# EAGLE design untitled (EAGLE 9.5.2)
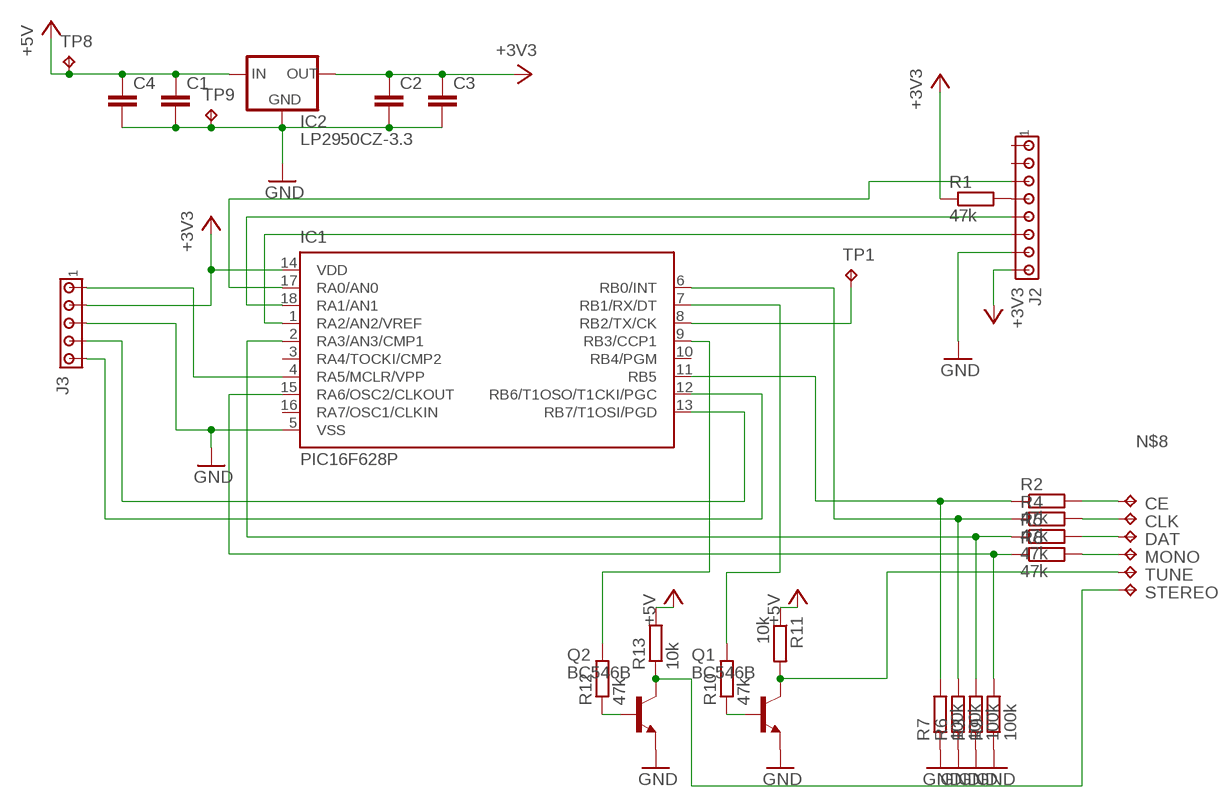
[diagram p0: schematic, sheet 1]

## Parts
C1  C-EU025-024X044  [C025-024X044]
C2  C-EU025-024X044  [C025-024X044]
C3  C-EU025-024X044  [C025-024X044]
C4  C-EU025-024X044  [C025-024X044]
CE  TPB1,27  [B1,27]
CLK  TPB1,27  [B1,27]
DAT  TPB1,27  [B1,27]
IC1  PIC16F628P  [DIL18]
IC2  LP2950CZ-3.3  [TO92]
J2  MTA08-100  [10X08MTA]
J3  MTA05-100  [10X05MTA]
MONO  TPB1,27  [B1,27]
Q1  BC546B  [TO92-EBC]
Q2  BC546B  [TO92-EBC]
R1  47k  R-EU_0204/7  [0204/7]
R2  47k  R-EU_0204/7  [0204/7]
R3  100k  R-EU_0204/7  [0204/7]
R4  47k  R-EU_0204/7  [0204/7]
R5  47k  R-EU_0204/7  [0204/7]
R6  100k  R-EU_0204/7  [0204/7]
R7  100k  R-EU_0204/7  [0204/7]
R8  47k  R-EU_0204/7  [0204/7]
R9  100k  R-EU_0204/7  [0204/7]
R10  47k  R-EU_0204/7  [0204/7]
R11  10k  R-EU_0204/7  [0204/7]
R12  47k  R-EU_0204/7  [0204/7]
R13  10k  R-EU_0204/7  [0204/7]
STEREO  TPB1,27  [B1,27]
TP1  TPB1,27  [B1,27]
TP8  TPB1,27  [B1,27]
TP9  TPB1,27  [B1,27]
TUNE  TPB1,27  [B1,27]

## Nets
+3V3: C2.1 C3.1 IC1.14(VDD) IC2.1(OUT) J2.8 J3.2 R1.1
+5V: C1.1 C4.1 IC2.3(IN) R11.1 R13.2 TP8.TP
GND: C1.2 C2.2 C3.2 C4.2 IC1.5(VSS) IC2.2(GND) J2.7 J3.3 Q1.E Q2.E R3.1 R6.1 R7.1 R9.1 TP9.TP
N$1: IC1.4(RA5/MCLR/VPP) J3.1
N$2: IC1.1(RA2/AN2/VREF) J2.6
N$3: IC1.18(RA1/AN1) J2.5
N$4: IC1.13(RB7/T1OSI/PGD) J3.4
N$5: IC1.12(RB6/T1OSO/T1CKI/PGC) J3.5
N$6: J2.4 R1.2
N$7: IC1.17(RA0/AN0) J2.3
N$8: CE.TP R2.2
N$9: IC1.8(RB2/TX/CK) TP1.TP
N$10: CLK.TP R4.2
N$11: DAT.TP R5.2
N$12: IC1.2(RA3/AN3/CMP1) R3.2 R5.1
N$13: IC1.6(RB0/INT) R4.1 R6.2
N$14: IC1.11(RB5) R2.1 R7.2
N$15: Q1.C R11.2 TUNE.TP
N$16: Q1.B R10.1
N$17: MONO.TP R8.2
N$18: IC1.15(RA6/OSC2/CLKOUT) R8.1 R9.2
N$19: Q2.C R13.1 STEREO.TP
N$20: IC1.7(RB1/RX/DT) R10.2
N$21: Q2.B R12.1
N$22: IC1.9(RB3/CCP1) R12.2
Unconnected: IC1.3(RA4/TOCKI/CMP2) IC1.10(RB4/PGM) IC1.16(RA7/OSC1/CLKIN) J2.1 J2.2

## Library data of the parts
C1-C4 = rcl:C-EU: CAPACITOR, European symbol; SPICEPREFIX: C
CE CLK DAT MONO STEREO TP1 TP8 TP9 TUNE = testpad:TP: Test pad
IC1 = microchip:PIC16F62*: FLASH-Based 8-Bit CMOS Microcontroller Source: http://ww1.microchip.com/downloads/en/DeviceDoc/40300C.pdf; MF: MICROCHIP; MPN: PIC16F628-04I/P; OC_FARNELL: 9760407; OC_NEWARK: 19C7272
IC2 = v-reg:LP2950?*: Source: http://cache.national.com/ds/LP/LP2950.pdf
J2 = con-amp:MTA08-100: AMP connector
J3 = con-amp:MTA05-100: AMP connector
Q1 Q2 = transistor-npn:BC546*: NPN Transistor
R1-R13 = rcl:R-EU_: RESISTOR, European symbol; SPICEPREFIX: R

## Board
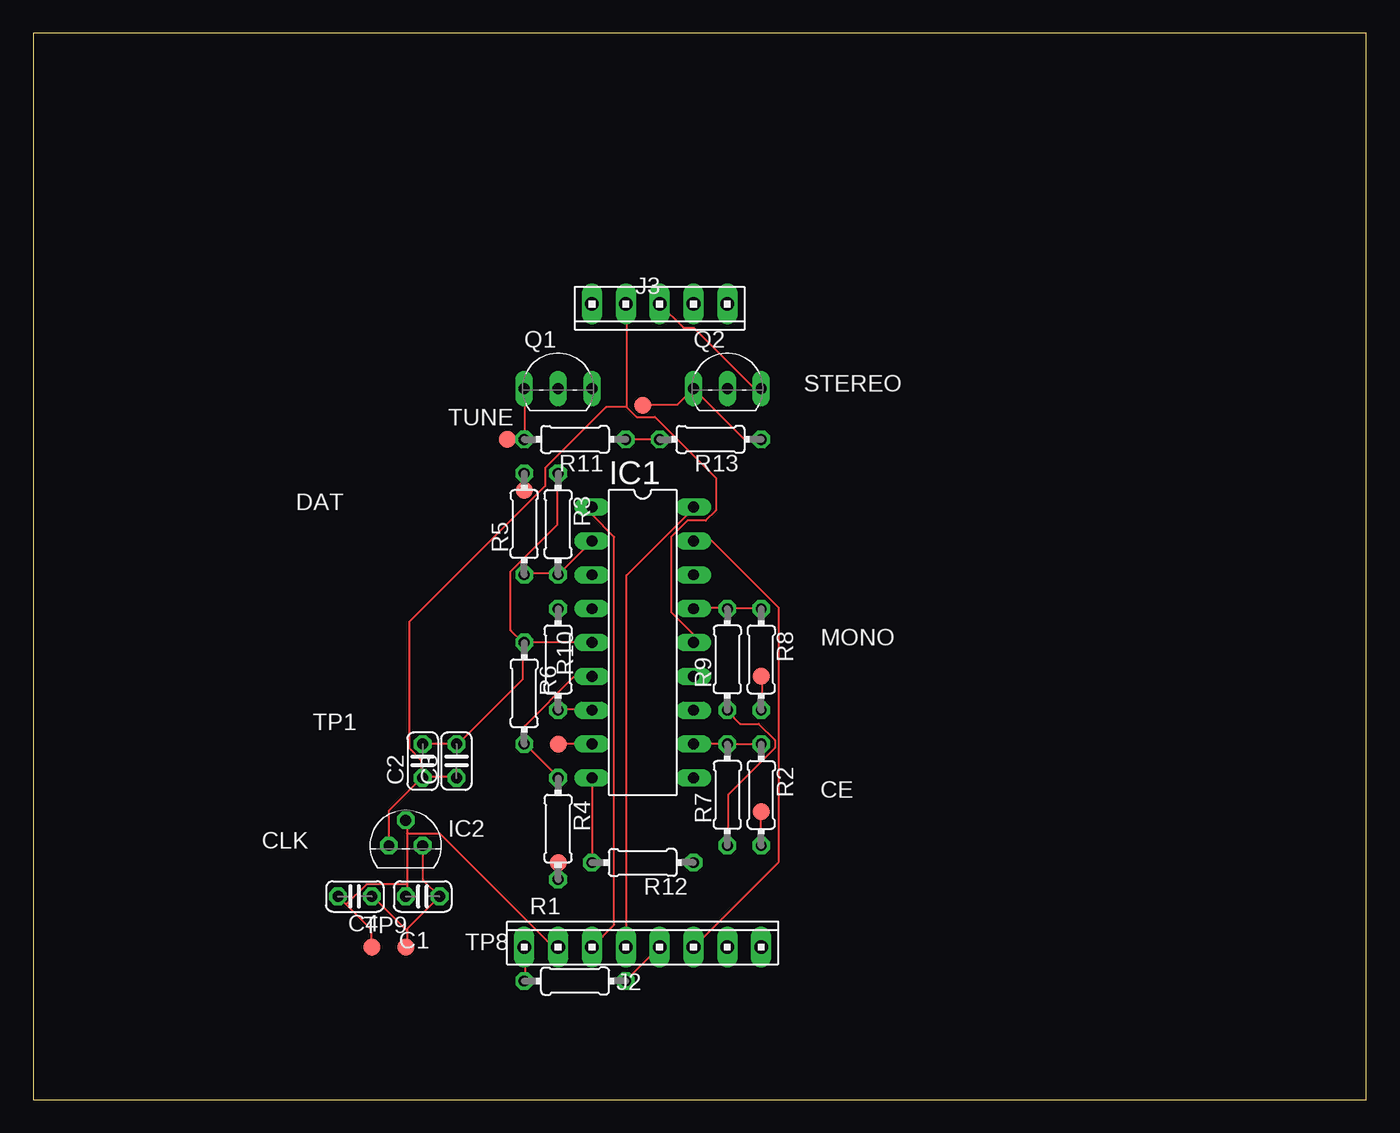
[diagram p1: board, top side]
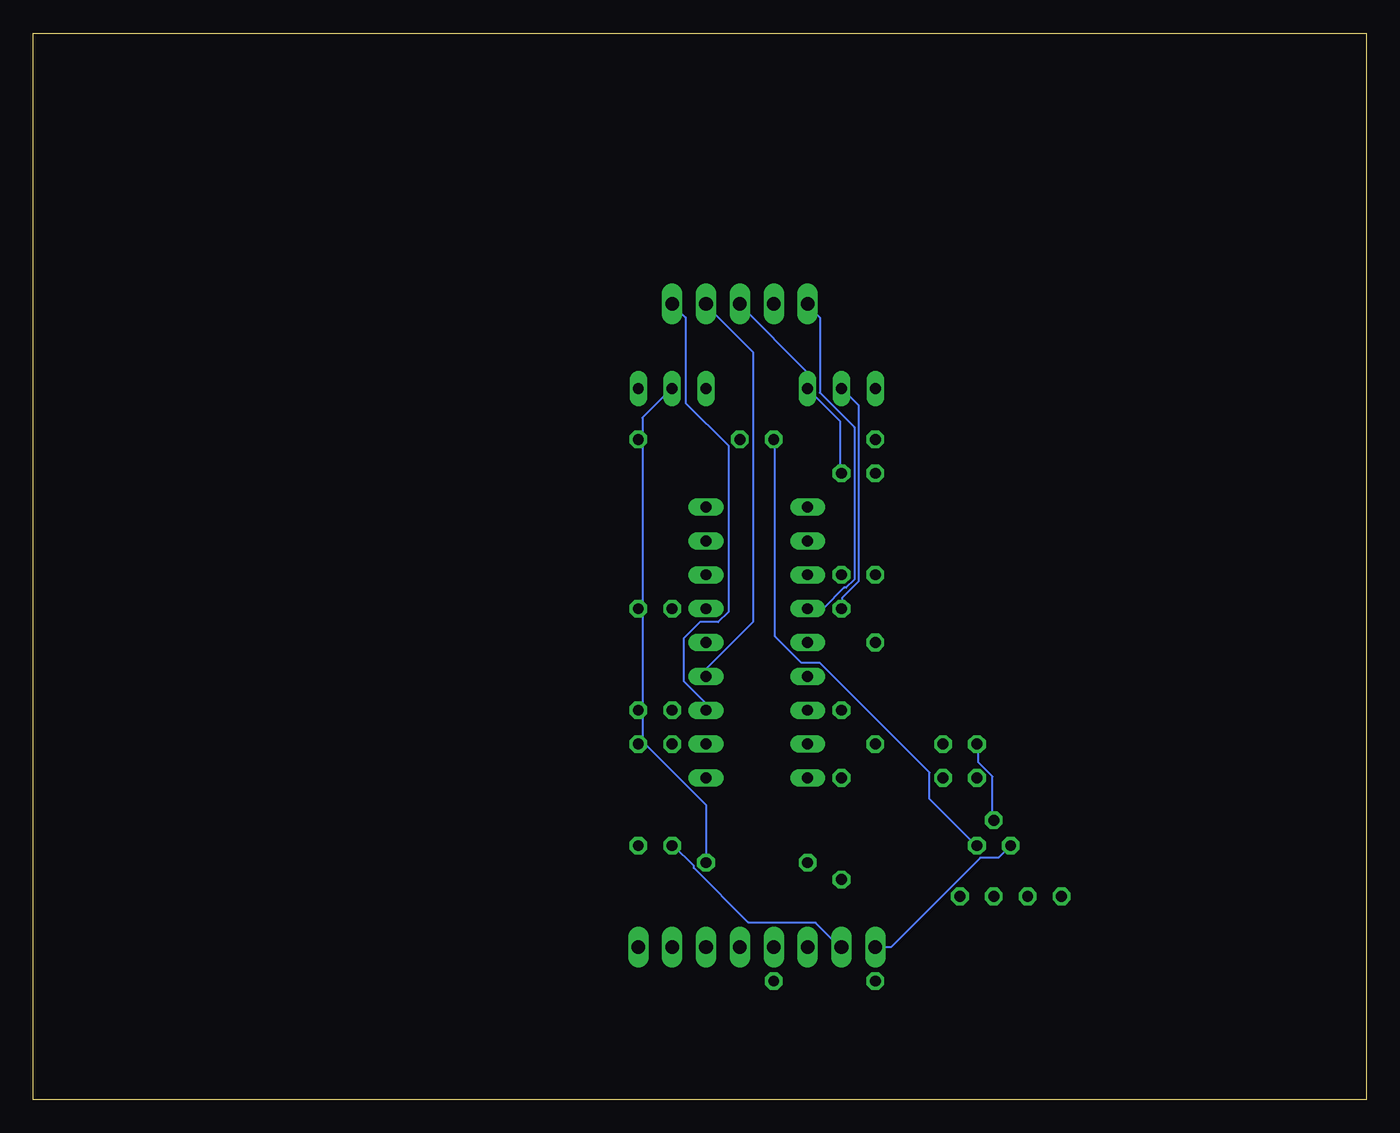
[diagram p2: board, bottom side, seen from below]

Size 100 x 80 mm. Coordinates in mm from the lower left corner, seen from the top.
Outline: 0,0 100,0 100,80 0,80 0,0
Copper layers (1*16): Top 0.035mm / dielectric 1.5mm / Bottom 0.035mm
Design rules "default": minimum track width 6mil, minimum drill 0.35mm, track to track 6mil, track to pad 6mil, pad to pad 6mil, via to via 6mil, smd to smd 6mil, copper to edge 40mil, drill to drill 6mil, minimum pad ring 10mil, minimum via ring 8mil, stop-mask expansion 4mil, vias tented up to drill 0mil, thermal gap 10mil

### Footprints (pad centres in the part's own frame; a part is rotated, then mirrored left to right if it is on the bottom)
C025-024X044 = drill 0.813 octagon: 1 -1.27,0; 2 1.27,0
B1,27 = smd 1.27 x 1.27: TP 0,0
DIL18 = drill 0.813 long: 1 -10.16,-3.81; 2 -7.62,-3.81; 3 -5.08,-3.81; 4 -2.54,-3.81; 5 0,-3.81; 6 2.54,-3.81; 7 5.08,-3.81; 8 7.62,-3.81; 9 10.16,-3.81; 10 10.16,3.81; 11 7.62,3.81; 12 5.08,3.81; 13 2.54,3.81; 14 0,3.81; 15 -2.54,3.81; 16 -5.08,3.81; 17 -7.62,3.81; 18 -10.16,3.81
TO92 = drill 0.813 octagon: 1 -1.27,0; 2 0,1.905; 3 1.27,0
10X08MTA = drill 1.016 long: 1 8.89,0; 2 6.35,0; 3 3.81,0; 4 1.27,0; 5 -1.27,0; 6 -3.81,0; 7 -6.35,0; 8 -8.89,0
10X05MTA = drill 1.016 long: 1 5.08,0; 2 2.54,0; 3 0,0; 4 -2.54,0; 5 -5.08,0
TO92-EBC = drill 0.813 long: B 0,-1.27; C -2.54,-1.27; E 2.54,-1.27
0204/7 = drill 0.813 octagon: 1 -3.81,0; 2 3.81,0

### Placement (x,y rotation side)
C1  29.21,15.24 180 top
C2  29.21,25.4 90 top
C3  31.75,25.4 90 top
C4  24.13,15.24 180 top
CE  54.61,21.59 0 top
CLK  39.37,17.78 0 top
DAT  36.83,45.72 0 top
IC1  45.72,34.29 270 top
IC2  27.94,19.05 0 top
J2  45.72,11.43 0 top
J3  46.99,59.69 180 top
MONO  54.61,31.75 0 top
Q1  39.37,54.61 0 top
Q2  52.07,54.61 0 top
R1  40.64,8.89 0 top
R2  54.61,22.86 270 top
R3  39.37,43.18 270 top
R4  39.37,20.32 270 top
R5  36.83,43.18 90 top
R6  36.83,30.48 270 top
R7  52.07,22.86 90 top
R8  54.61,33.02 270 top
R9  52.07,33.02 90 top
R10  39.37,33.02 270 top
R11  40.64,49.53 180 top
R12  45.72,17.78 180 top
R13  50.8,49.53 180 top
STEREO  45.72,52.07 0 top
TP1  39.37,26.67 0 top
TP8  27.94,11.43 0 top
TP9  25.4,11.43 0 top
TUNE  35.56,49.53 0 top

### Tracks (layer width: path | path; a pad name or v marks a point on that pad's centre or on a via)
+3V3
  Top 0.152: R1.1 36.88,8.99 36.88,11.43 J2.8 | IC2.1 26.67,21.64 29.11,24.08 C2.1 | C3.1 31.7,24.23 29.26,24.23 C2.1 | IC1.14 49.53,34.9 47.85,36.58 47.85,42.22 49.07,43.43 50.44,43.43 51.21,44.2 51.21,46.63 46.63,51.21 45.26,51.21 44.5,51.97 | 44.5,51.97 44.5,59.59 J3.2 | 44.5,51.97 42.98,51.97 38.41,47.4 38.41,46.02 28.19,35.81 28.19,26.36 29.11,25.45 29.11,24.23 C2.1
  Bottom 0.152: J2.8 35.66,11.43 28.96,18.14 27.58,18.14 IC2.1
+5V
  Top 0.152: R13.2 R11.1 | 28.04,12.65 28.04,12.8 C1.1 29.26,16.46 29.26,19.05 IC2.3 | 28.04,12.65 28.04,11.43 TP8.TP | 28.04,12.65 25.45,15.24 C4.1
  Bottom 0.152: R11.1 44.35,49.53 44.35,34.75 42.37,32.77 41,32.77 32.77,24.54 32.77,22.55 29.26,19.05 IC2.3
GND
  Top 0.152: Q2.E 54.1,53.34 49.53,57.91 48.77,57.91 J3.3 | R7.1 52.12,19.05 52.12,22.86 55.63,26.36 55.63,26.98 54.41,28.19 53.03,28.19 52.12,29.11 R9.1 | IC1.5 R6.1 36.73,34.29 | C4.2 23.47,14.63 | 23.47,14.63 25.3,12.8 25.4,11.33 TP9.TP | C2.2 C3.2 31.85,26.67 36.73,31.55 36.73,34.29 | 28.04,19.96 28.04,20.88 IC2.2 | 28.04,19.96 28.04,16.15 | 28.04,16.15 28.04,15.24 C1.2 | J2.7 39.01,11.43 30.48,19.96 28.04,19.96 | 23.47,14.63 24.99,16.15 28.04,16.15 | 36.73,34.29 35.81,35.2 35.81,39.62 39.32,43.13 39.32,46.94 R3.1
  Bottom 0.152: R3.1 39.47,47.09 39.47,50.9 Q1.E 41.91,54.56 46.94,59.59 J3.3 | C2.2 29.11,26.67 29.11,25.3 28.04,24.23 28.04,21.03 IC2.2 | R7.1 51.97,19.05 50.44,17.53 50.44,17.37 46.33,13.26 41.3,13.26 39.47,11.43 J2.7
N$1
  Bottom 0.152: IC1.4 41.91,36.88 40.69,36.88 39.17,38.41 39.01,38.41 38.41,39.01 38.41,50.44 41,53.03 41,58.67 41.91,59.59 J3.1
N$2
  Top 0.152: IC1.1 41.91,43.89 43.59,42.22 43.59,13.11 J2.6
N$3
  Top 0.152: IC1.18 49.53,44.35 44.5,39.32 44.5,11.43 J2.5
N$4
  Bottom 0.152: IC1.13 49.53,32.31 46.02,35.81 46.02,56.08 49.53,59.59 J3.4
N$5
  Bottom 0.152: IC1.12 49.53,29.72 51.21,31.39 51.21,34.59 49.99,35.81 48.62,35.81 47.85,36.58 47.85,49.07 51.05,52.27 51.05,58.67 J3.5
N$6
  Top 0.152: R1.2 44.5,8.99 46.94,11.43 J2.4
N$7
  Top 0.152: IC1.17 50.9,41.91 55.93,36.88 55.93,17.83 J2.3
N$8
  Top 0.152: CE.TP R2.2 54.71,19.05
N$9
  Top 0.152: IC1.8 TP1.TP
N$10
  Top 0.152: R4.2 CLK.TP
N$11
  Top 0.152: DAT.TP 36.88,45.72 36.88,46.94 R5.2
N$12
  Top 0.152: R5.1 36.88,39.47 39.32,39.47 R3.2 IC1.2
N$13
  Top 0.152: 36.88,26.67 39.32,24.23 R4.1 | 36.88,26.67 36.88,28.04 40.54,31.7 41.91,31.7 IC1.6 | 36.88,26.67 R6.2
N$14
  Top 0.152: IC1.11 R7.2 R2.1
N$15
  Top 0.152: TUNE.TP R11.2 36.88,49.53 36.88,53.34 Q1.C
N$16
  Bottom 0.152: R10.1 39.32,36.88 39.32,37.64 38.1,38.86 38.1,52.12 39.32,53.34 Q1.B
N$17
  Top 0.152: MONO.TP 54.71,31.7 54.71,29.26 R8.2
N$18
  Top 0.152: IC1.15 49.53,36.88 51.97,36.88 R9.2 52.12,36.88 54.56,36.88 R8.1
N$19
  Top 0.152: STEREO.TP 45.72,52.12 48.31,52.12 Q2.C 53.34,49.53 R13.1
N$20
  Top 0.152: R10.2 39.47,29.26 41.91,29.26 IC1.7
N$21
  Bottom 0.152: R12.1 49.53,22.1 54.3,26.87 54.3,51.16 52.12,53.34 Q2.B
N$22
  Top 0.152: IC1.9 R12.2